# EAGLE design picoclick_c3_v1.1 (EAGLE 9.6.2)
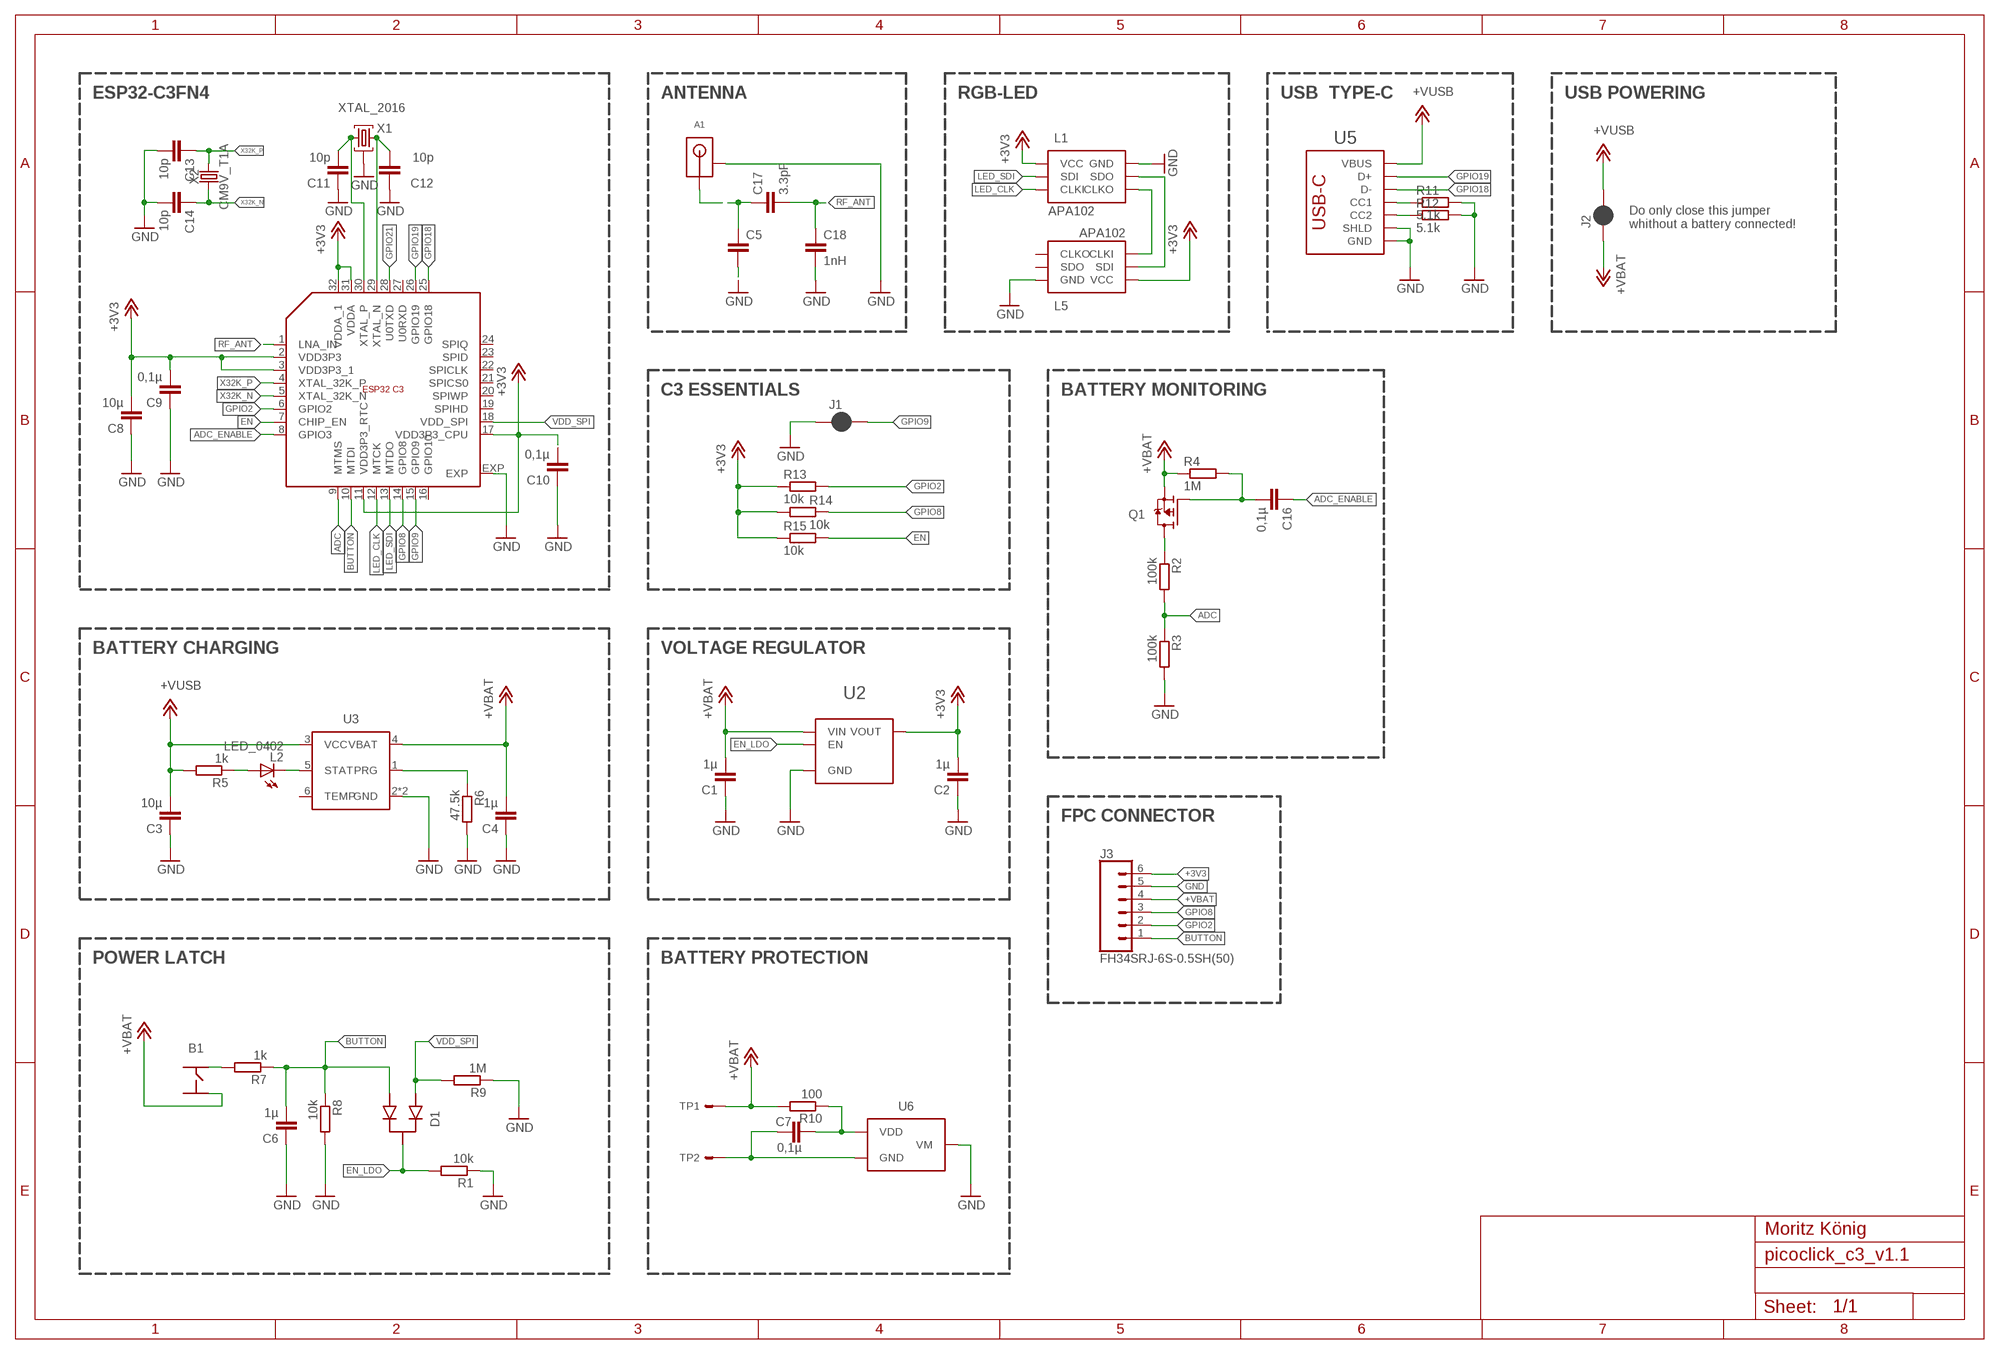
[diagram p0: schematic, sheet 1]

## Parts
A1  RFECA3216060A1T_NEW3_M  [RFECA3216060A1T_NEW3_M]
B1  BUTTON_4PIN  [BUTTON_SMD_12MM]
C1  1µ  C0402_S  [C0402_S]
C2  1µ  C0402_S  [C0402_S]
C3  10µ  C0402_S  [C0402_S]
C4  1µ  C0402_S  [C0402_S]
C5  C0402_S  [C0402_S]
C6  1µ  C0402_S  [C0402_S]
C7  0,1µ  C-EU-0402-WOKEEPOUT_S  [C0402_S]
C8  10µ  C0402_S  [C0402_S]
C9  0,1µ  C0402_S  [C0402_S]
C10  0,1µ  C0402_S  [C0402_S]
C11  10p  C0402_S  [C0402_S]
C12  10p  C0402_S  [C0402_S]
C13  10p  C-EU-0402-WOKEEPOUT_S  [C0402_S]
C14  10p  C-EU-0402-WOKEEPOUT_S  [C0402_S]
C16  0,1µ  C0402_S  [C0402_S]
C17  3.3pF  C0402_S  [C0402_S]
C18  1nH  C0402_S  [C0402_S]
D1  DAN222  [SOT523]
J1  SMT_JUMPER_2_NC_PASTE  [JUMPER_SMALL]
J2  JUMPER_SMALL  [JUMPER_SMALL]
J3  FH34SRJ-6S-0.5SH(50)  [FH34SRJ-6S-0.5SH(50)]
L1  APA102_2020  [APA102_2020]
L2  LED_0402  [CHIPLED_0402]
L5  APA102_2020  [APA102_2020]
Q1  WPM2031+SOT1123  [SOT723+1123]
R1  10k  R0402  [R0402]
R2  100k  R0402  [R0402]
R3  100k  R0402  [R0402]
R4  1M  R0402  [R0402]
R5  1k  R0402  [R0402]
R6  47.5k  R0402  [R0402]
R7  1k  R0402  [R0402]
R8  10k  R0402  [R0402]
R9  1M  R0402  [R0402]
R10  100  R-EU-0402-WOKEEPOUT  [R0402]
R11  5.1k  R0402  [R0402]
R12  5.1k  R0402  [R0402]
R13  10k  R0402  [R0402]
R14  10k  R0402  [R0402]
R15  10k  R0402  [R0402]
TP1  TP/SP-1.5X2.0  [SOLDERPAD_1.5X2.0]
TP2  TP/SP-1.5X2.0  [SOLDERPAD_1.5X2.0]
U1  ESP32_C3_QFN32  [QFN32]
U2  MIC5504  [TDFN4]
U3  WS4518D  [DFN-6]
U5  USB_C_C393939  [USBC_C393939]
U6  XB6042I2SV  [TDFN4]
X1  XTAL_2016  [XTAL_2016]
X2  CM9V_T1A  [XTAL_1016]

## Nets
+3V3: C2.P$2 C8.P$2 C9.P$2 C10.P$2 J3.6 L1.P1(VCC) L1.P1.1(VCC) L5.P1(VCC) L5.P1.1(VCC) R13.1 R14.1 R15.1 U1.2(VDD3P3) U1.3(VDD3P3_1) U1.11(VDD3P3_RTC) U1.17(VDD3P3_CPU) U1.31(VDDA) U1.32(VDDA_1) U2.P1(VOUT)
+VBAT: B1.P4 C1.P$2 C4.P$2 J2.P$1 J3.4 Q1.P$2(S) R4.1 R10.2 TP1.1(S) U2.P4(VIN) U3.4(VBAT)
+VUSB: C3.P$2 J2.P$2 R5.2 U3.3(VCC) U5.A4B9(VBUS) U5.B4A9(VBUS)
ADC: R2.2 R3.1 U1.9(MTMS)
ADC_ENABLE: C16.P$1 U1.8(GPIO3)
BUTTON: C6.P$2 D1.2 J3.1 R7.1 R8.1 U1.10(MTDI)
EN: R15.2 U1.7(CHIP_EN)
EN_LDO: D1.3 R1.2 U2.P3(EN)
GND: A1.PGND1(GND) A1.PGND2(GND) C1.P$1 C2.P$1 C3.P$1 C4.P$1 C5.P$2 C6.P$1 C8.P$1 C9.P$1 C10.P$1 C11.P$1 C12.P$1 C13.P$2 C14.P$2 C18.P$2 J1.P$1 J3.5 L1.P6(GND) L1.P6.1(GND) L5.P6(GND) L5.P6.1(GND) R1.1 R3.2 R6.2 R8.2 R9.1 R11.2 R12.2 U1.EXP U2.EXP(GND) U2.P2(GND) U3.2(GND) U3.EXP(GND) U5.A1B12(GND) U5.B1A12(GND) U5.S1(SHLD) U5.S2(SHLD) U5.S3(SHLD) U5.S4(SHLD) U6.P4(VM) X1.P2(G) X1.P4(G)
GPIO2: J3.2 R13.2 U1.6(GPIO2)
GPIO8: J3.3 R14.2 U1.14(GPIO8)
GPIO9: J1.P$2 U1.15(GPIO9)
GPIO18: U1.25(GPIO18) U5.A7(D-) U5.B7(D-)
GPIO19: U1.26(GPIO19) U5.A6(D+) U5.B6(D+)
GPIO21: U1.28(U0TXD)
LED_CLK: L1.P5(CLKI) U1.12(MTCK)
LED_SDI: L1.P4(SDI) U1.13(MTDO)
N$1: L1.P3(SDO) L5.P4(SDI)
N$2: R6.1 U3.1(PRG)
N$3: R12.1 U5.B5(CC2)
N$4: L1.P2(CLKO) L5.P5(CLKI)
N$7: R11.1 U5.A5(CC1)
N$11: A1.PFEED(ANT) C5.P$1 C17.P$1
N$12: C11.P$2 U1.30(XTAL_P) X1.P1
N$13: C12.P$2 U1.29(XTAL_N) X1.P3
N$15: B1.P2 R7.2
N$17: L2.P$2(A) R5.1
N$19: L2.P$1(C) U3.5(STAT)
N$20: Q1.P$3(D) R2.1
N$21: C16.P$2 Q1.P$1(G) R4.2
N$22: C7.P$2 R10.1 U6.P1(VDD)
N$24: C7.P$1 TP2.1(S) U6.EXP(GND) U6.P2(GND) U6.P3(GND)
RF_ANT: C17.P$2 C18.P$1 U1.1(LNA_IN)
VDD_SPI: D1.1 R9.2 U1.18(VDD_SPI)
X32K_N: C14.P$1 U1.5(XTAL_32K_N) X2.P$1
X32K_P: C13.P$1 U1.4(XTAL_32K_P) X2.P$2
Unconnected: B1.P1 B1.P3 L5.P2(CLKO) L5.P3(SDO) U1.16(GPIO10) U1.19(SPIHD) U1.20(SPIWP) U1.21(SPICS0) U1.22(SPICLK) U1.23(SPID) U1.24(SPIQ) U1.27(U0RXD) U3.6(TEMP)

## Notes on the sheet
- ESP32-C3FN4 | ANTENNA | RGB-LED | USB  TYPE-C | USB POWERING
- Do only close this jumper 
  whithout a battery connected!
- C3 ESSENTIALS | BATTERY MONITORING
- BATTERY CHARGING | VOLTAGE REGULATOR
- FPC CONNECTOR
- POWER LATCH | BATTERY PROTECTION
- Moritz König

## Library data of the parts
A1 = moekoe_antennas:RFECA3216060A1T
B1 = moekoe_switches:BUTTON_4PIN
C1-C6 C8-C12 C16-C18 = moekoe_rcl:C0402
C7 C13 C14 = moekoe:C-EU-0402-WOKEEPOUT
D1 = moekoe_discrete:DAN222
J1 = moekoe_pads_jumpers:SMT_JUMPER_2_NC_PASTE
J2 = moekoe:JUMPER_SMALL
J3 = moekoe_hardware:FH34SRJ-6S-0.5SH(50)
L1 L5 = moekoe_led:APA102_2020
L2 = moekoe_led:LED_0402
Q1 = moekoe_discrete:WPM2031
R1-R9 R11-R15 = moekoe_rcl:R0402
R10 = moekoe:R-EU-0402-WOKEEPOUT
TP1 TP2 = iml_elc:TP/SP: Solderpads/Testpads
U1 = moekoe_controllers:ESP32_C3_QFN32
U2 = moekoe_ics:MIC5504
U3 = moekoe_ics:WS4518D
U5 = moekoe_hardware:USB_C_C393939
U6 = moekoe:XB6042I2SV
X1 = moekoe_discrete:XTAL_2016
X2 = moekoe:CM9V_T1A

## Board
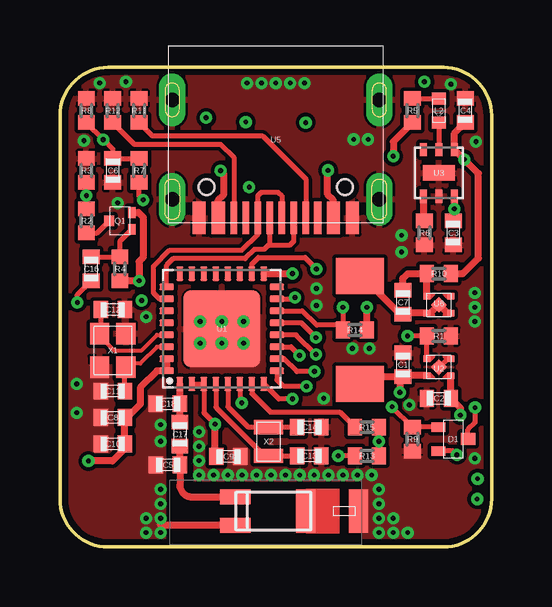
[diagram p1: board, top side]
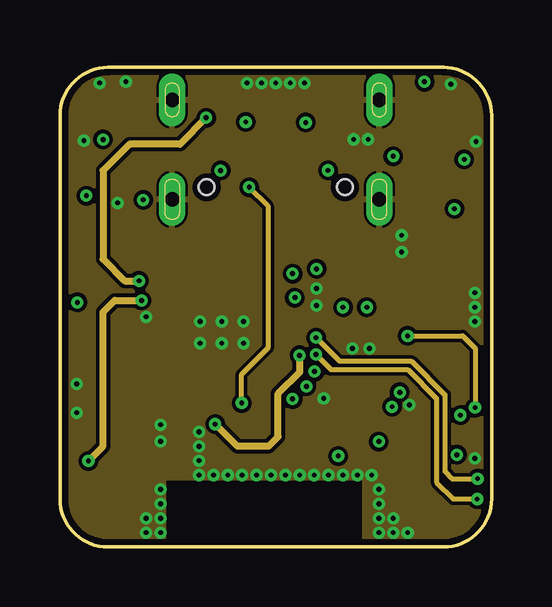
[diagram p2: board, inner layer Route2]
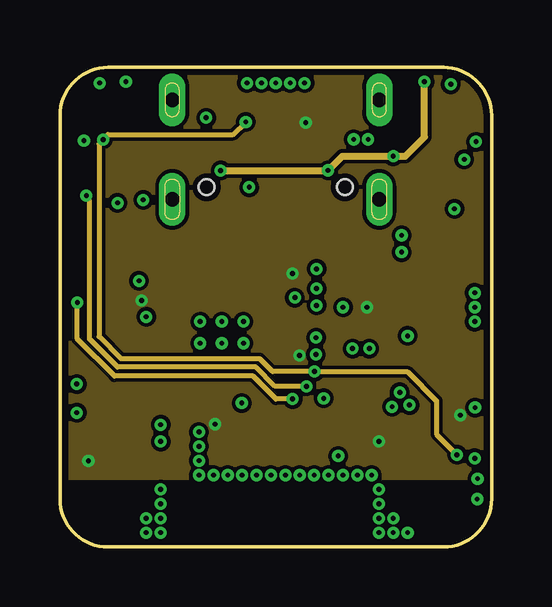
[diagram p3: board, inner layer Route15]
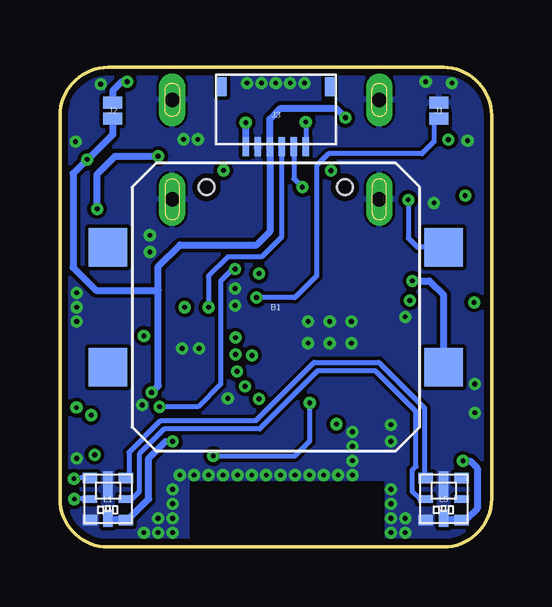
[diagram p4: board, bottom side, seen from below]

Size 18 x 20 mm. Coordinates in mm from the lower left corner, seen from the top.
Outline: 18,2 18,18 arc90 16,20 2,20 arc90 0,18 0,2 arc90 2,0 16,0 arc90 18,2
Copper layers (1+2*15+16): Top 0.035mm / dielectric 0.2mm / Route2 0.0175mm / dielectric 0.265mm / Route15 0.0175mm / dielectric 0.2mm / Bottom 0.035mm
Design rules "2020.08.24_4layers_eagle *": minimum track width 6mil, minimum drill 0.2mm, track to track 6mil, track to pad 6mil, pad to pad 6mil, via to via 6mil, smd to smd 6mil, copper to edge 10mil, drill to drill 6mil, minimum pad ring 10mil, minimum via ring 6mil, stop-mask expansion 0mil, vias tented up to drill 0.5mm, thermal gap 4mil
tRestrict: area 4.5,2.8 to 5.5,6.8

### Footprints (pad centres in the part's own frame; a part is rotated, then mirrored left to right if it is on the bottom)
RFECA3216060A1T_NEW3_M = smd 0.8 x 1.8: P2 -1.25,-0.1; PGND2 -3.45,-0.1 | smd 1.27 x 0.635: PFEED 1.685,-0.69; PGND1 1.685,0.49
BUTTON_SMD_12MM = smd 1.6 x 1.6: P1 -7,2.5; P2 7,2.5; P3 -7,-2.5; P4 7,-2.5
C0402_S = smd 0.6 x 0.7: P$1 -0.5,0; P$2 0.5,0
SOT523 = smd 0.4 x 0.6: 1 0.5,0.62; 2 -0.5,0.62 | smd 0.5 x 0.6: 3 0,-0.62
JUMPER_SMALL = smd 0.5 x 0.8: P$1 -0.33,0; P$2 0.33,0
FH34SRJ-6S-0.5SH(50) = smd 0.28 x 0.8: 1 -1.25,0; 2 -0.75,0; 3 -0.25,0; 4 0.25,0; 5 0.75,0; 6 1.25,0 | smd 0.4 x 0.8: P$1 -2.25,-2.5; P$2 2.25,-2.5
APA102_2020 = smd 0.6 x 0.45: P1 -0.75,0.875; P3 -0.75,-0.875; P4 0.75,-0.875; P6 0.75,0.875 | smd 0.4 x 0.7: P1.1 0,0.8 | smd 0.6 x 0.3: P2 -0.75,0; P5 0.75,0 | smd 0.4 x 1.1: P6.1 0,-0.6
CHIPLED_0402 = smd 0.5 x 0.6: P$1 -0.5,0; P$2 0.5,0
SOT723+1123 = smd 0.45 x 0.3: P$1 -0.35,-0.5; P$2 0.35,-0.5 | smd 0.45 x 0.4: P$3 0,0.45
R0402 = smd 0.6 x 0.7: 1 -0.5,0; 2 0.5,0
SOLDERPAD_1.5X2.0 = smd 2 x 1.5: 1 0,0
QFN32 = smd 0.6 x 0.275: 1 -2.3,1.75; 2 -2.3,1.25; 3 -2.3,0.75; 4 -2.3,0.25; 5 -2.3,-0.25; 6 -2.3,-0.75; 7 -2.3,-1.25; 8 -2.3,-1.75; 17 2.3,-1.75; 18 2.3,-1.25; 19 2.3,-0.75; 20 2.3,-0.25; 21 2.3,0.25; 22 2.3,0.75; 23 2.3,1.25; 24 2.3,1.75 | smd 0.275 x 0.6: 9 -1.75,-2.3; 10 -1.25,-2.3; 11 -0.75,-2.3; 12 -0.25,-2.3; 13 0.25,-2.3; 14 0.75,-2.3; 15 1.25,-2.3; 16 1.75,-2.3; 25 1.75,2.3; 26 1.25,2.3; 27 0.75,2.3; 28 0.25,2.3; 29 -0.25,2.3; 30 -0.75,2.3; 31 -1.25,2.3; 32 -1.75,2.3 | smd 3.2 x 3.2: EXP 0,0
TDFN4 = smd 0.48 x 0.48 rotated 45: EXP 0,0 | smd 0.25 x 0.3: P1 -0.35,-0.5; P2 0.35,-0.5; P3 0.35,0.5; P4 -0.35,0.5
DFN-6 = smd 0.55 x 0.3: 1 -0.975,0.65; 2 -0.975,0; 3 -0.975,-0.65; 4 0.975,-0.65; 5 0.975,0; 6 0.975,0.65 | smd 0.65 x 1.35: EXP 0,0
USBC_C393939 = smd 0.55 x 1.35: A1B12 -3.2,0.775; A4B9 -2.4,0.775; B1A12 3.2,0.775; B4A9 2.4,0.775 | smd 0.275 x 1.35: A5 -1.25,0.775; A6 -0.25,0.775; A7 0.25,0.775; B5 1.75,0.775; B6 0.75,0.775; B7 -0.75,0.775; B8 1.25,0.775 | smd 0.3 x 1.35: A8 -1.75,0.775 | drill 0.6 pad 1 long: S1 -4.32,0; S2 4.32,0; S3 -4.32,-4.15; S4 4.32,-4.15 | hole 0.65: 2.89,-0.5; -2.89,-0.5
XTAL_2016 = smd 0.9 x 0.8: P1 -0.7,-0.55; P2 0.7,-0.55; P3 0.7,0.55; P4 -0.7,0.55
XTAL_1016 = smd 0.6 x 1.2: P$1 -0.6,0; P$2 0.6,0

### Placement (x,y rotation side)
A1  9,1.4 180 top
B1  9,10 0 bottom
C1  14.3,7.6 270 top
C2  15.8,6.2 0 top
C3  16.4,13.1 90 top
C4  16.9,18.2 270 top
C5  4.5,3.42 180 top
C6  2.2,15.7 90 top
C7  14.3,10.2 90 top
C8  2.2,5.4 0 top
C9  7.03,3.77 180 top
C10  2.2,4.3 0 top
C11  2.2,6.5 0 top
C12  2.2,9.9 180 top
C13  10.4,3.8 0 top
C14  10.4,5 0 top
C16  1.3,11.6 90 top
C17  5,4.7 90 top
C18  4.5,5.97 180 top
D1  16.4,4.5 90 top
J1  2.2,18.2 270 bottom
J2  15.8,18.2 90 bottom
J3  9,16.7 180 bottom
L1  16,2 180 bottom
L2  15.8,18.2 90 top
L5  2,2 180 bottom
Q1  2.5,13.6 90 top
R1  15.8,8.8 180 top
R2  1.1,13.6 90 top
R3  1.1,15.7 90 top
R4  2.5,11.6 90 top
R5  14.7,18.2 270 top
R6  15.2,13.1 270 top
R7  3.3,15.7 270 top
R8  1.1,18.2 90 top
R9  14.7,4.5 90 top
R10  15.8,11.4 0 top
R11  3.3,18.2 90 top
R12  2.2,18.2 90 top
R13  12.8,3.8 180 top
R14  12.3,9.05 180 top
R15  12.8,5 180 top
TP1  12.5,6.8 0 top
TP2  12.5,11.3 0 top
U1  6.75,9.1 90 top
U2  15.8,7.5 90 top
U3  15.8,15.6 90 top
U5  9,14.5 180 top
U6  15.8,10.1 270 top
X1  2.2,8.2 90 top
X2  8.7,4.4 270 top

### Tracks (layer width: path | path; a pad name or v marks a point on that pad's centre or on a via)
+3V3  (via drill 0.2 pad 0.4)
  Top 0.2: U1.2 U1.3 6,5.6 v6.47,5.12 | U1.11 9.64,8.35 v9.99,8
  Top 0.3: U2.P1 C2.P$2 16.7,5.8 v16.7,5.5 | R15.1 v13.3,4.4 R13.1 | U1.17 v9.7,11.4 | U1.31 U1.32 4.05,7.35 3.35,6.65 3.35,5.95 2.8,5.4 C8.P$2 C10.P$2 2.7,4.1 2.19,3.59 v1.19,3.59 | R14.1 v12.8,10 | C9.P$2 6.47,3.77 v6.47,5.12
  Route2 0.3: v6.47,5.12 7.4,4.2 8.7,4.2 9.1,4.6 9.1,6.4 9.99,7.29 v9.99,8 | v1.19,3.59 1.8,4.2 1.8,9.8 2.28,10.28 v3.4,10.28
  Bottom 0.3: L5.P1.1 1.93,1.12 L5.P1 1.07,1.12 0.6,1.6 0.6,3.3 0.89,3.59 v1.19,3.59 | L1.P1.1 15.93,1.12 L1.P1 15.18,1.12 14.29,2 14.29,3.71 13.6,4.4 v13.3,4.4 | J3.6 v10.25,17.7
  pour Route15: 0.25,2.88 0.25,17.75 arc-90 2.25,19.75 15.75,19.75 arc-90 17.75,17.75 17.75,2.88
+VBAT  (via drill 0.2 pad 0.4)
  Top 0.3: U2.P4 14.35,7.15 C1.P$2 | C1.P$2 12.8,7.1 TP1.1 | C4.P$2 16.45,17.25 U3.4 v16.86,16.16 17.45,15.57 17.45,12.05 16.8,11.4 R10.2 | R4.1 v3.3,11.1 3.3,11.9 3.48,12.07 3.48,13.75 3.27,13.95 Q1.P$2 | C1.P$2 14.18,6.97 v14.18,6.45
  Route2 0.3: v6.1,17.9 5,16.8 2.9,16.8 1.8,15.7 1.8,12 2.7,11.1 v3.3,11.1
  Bottom 0.3: J2.P$1 15.8,17.2 16.84,16.16 v16.86,16.16 17.45,15.57 17.45,11.65 16.5,10.7 13.9,10.7 | B1.P4 2,10.5 2.6,11.1 v3.3,11.1 | v14.18,6.45 13.9,6.72 13.9,10.7 | 13.9,10.7 13.9,11.7 13,12.6 9.8,12.6 9.25,13.15 J3.4 9.25,17.85 8.8,18.3 6.5,18.3 v6.1,17.9
+VUSB  (via drill 0.2 pad 0.4)
  Top 0.3: U5.B4A9 6.6,14.46 6.84,14.7 6.84,15.56 v6.7,15.7 | U5.A4B9 11.4,14.46 11.16,14.7 11.16,15.69 v11.18,15.71 | U3.3 v16.45,14.1 16.45,13.65 C3.P$2 | R5.2 13.9,16.9 v13.9,16.3
  Route15 0.3: v6.7,15.7 v11.18,15.7 v11.18,15.71 11.78,16.3 v13.9,16.3 14.4,16.3 15.2,17.1 v15.2,19.4
  Bottom 0.3: v15.2,19.4 15.43,19.4 15.8,19.03 J2.P$2 | v16.45,14.1 16.45,15.55 15.7,16.3 v13.9,16.3
ADC  (via drill 0.2 pad 0.4)
  Top 0.2: R3.1 v1.1,14.65 R2.2 | v10.28,6.7 9.32,6.7 9.05,6.97 U1.9
  Route15 0.2: v10.28,6.7 8.97,6.7 8.18,7.5 2.4,7.5 1.23,8.67 1.23,14.45 1.1,14.57 v1.1,14.65
ADC_ENABLE  (via drill 0.2 pad 0.4)
  Top 0.2: U1.8 9.12,6.17 v9.7,6.17 | v0.72,10.2 0.72,10.53 C16.P$1
  Route15 0.2: v9.7,6.17 9,6.17 8.05,7.12 2.27,7.12 0.72,8.68 v0.72,10.2
BUTTON  (via drill 0.2 pad 0.4)
  Top 0.2: U1.10 9.35,7.85 9.88,7.32 v10.62,7.32 | R8.1 v1.8,17 | v1.8,17 2.2,16.6 C6.P$2 R7.1 | v1.8,17 | v16.56,3.85 16.4,4 D1.2
  Route15 0.2: v16.56,3.85 15.7,4.7 15.7,6.1 14.48,7.32 v10.62,7.32 8.87,7.32 8.33,7.85 2.54,7.85 1.62,8.77 1.62,16.82 v1.8,17 2,17.2 7.22,17.2 v7.75,17.73
  Bottom 0.2: v7.75,17.73 J3.1
EN
  Top 0.2: U1.7 8,6.4 8.78,5.62 11.68,5.62 R15.2
EN_LDO  (via drill 0.2 pad 0.4)
  Top 0.2: U2.P3 R1.2 v14.51,8.8 v14.5,8.8 | D1.3 17.02,4.9 17.32,5.2 v17.32,5.82
  Route2 0.2: v14.5,8.8 16.8,8.8 17.32,8.29 v17.32,5.82
GND  (via drill 0.2 pad 0.4)
  Top 0.2: U2.EXP 16.15,7.85 U2.P2
  Top 0.3: A1.PGND1 4.2,0.91 v4.2,1.2
  other vias: 16.3,19.3 4.2,2.4 4.2,1.8 4.2,0.6 6.4,3 7,3 7.6,3 8.2,3 8.8,3 9.4,3 10,3 10.6,3 11.2,3 11.8,3 12.4,3 13,3 13.3,2.4 13.3,1.8 13.3,1.2 13.3,0.6 6.75,8.5 13.9,0.6 14.5,0.6 3.6,0.6 3.6,1.2 13.9,1.2 3.6,9.6 0.7,6.8 1,16.95 2.4,14.35 17.3,10.6 17.3,10 17.3,9.4 14.57,5.92 6.75,9.4 5.85,8.5 5.85,9.4 7.65,9.4 7.65,8.5 9,19.35 8.4,19.35 7.8,19.35 9.6,19.35 10.2,19.35 2.75,19.4 1.65,19.35 12.25,17 12.85,17 14.25,13 11,6.2 17.3,3.7 0.7,5.6 17.35,16.9 14.25,12.3 12.2,8.28 12.9,8.28 10.7,10.78 10.7,10.07 5.8,3 5.8,3.6 5.8,4.2 5.8,4.8 4.2,4.4 4.2,5.1
  pour Route2: 0.25,2.85 0.25,17.75 arc-90 2.25,19.75 15.75,19.75 arc-90 17.75,17.75 17.75,2.85
  pour Top: 0.25,6.95 0.25,17.75 arc-90 2.25,19.75 15.75,19.75 arc-90 17.75,17.75 17.75,6.95
  pour Bottom: 0.25,2.85 0.25,17.75 arc-90 2.25,19.75 15.75,19.75 arc-90 17.75,17.75 17.75,2.85
  pour Top (no thermals): 12.7,3.7 12.7,0.25 15.75,0.25 arc90 17.75,2.25 17.75,3.7
  pour Top (no thermals): 0.25,7.5 0.25,2.25 arc90 2.25,0.25 4.35,0.25 4.35,7.5
  pour Top (no thermals): 5.5,9.6 5.5,2.85 9.4,2.85 9.4,9.6
  pour Bottom (no thermals): 0.25,3.4 0.25,2.25 arc90 2.25,0.25 4.35,0.25 4.35,3.4
  pour Route2 (no thermals): 0.25,3.4 0.25,2.25 arc90 2.25,0.25 4.35,0.25 4.35,3.4
  pour Bottom (no thermals): 12.7,3.7 12.7,0.25 15.75,0.25 arc90 17.75,2.25 17.75,3.7
  pour Route2 (no thermals): 12.7,3.7 12.7,0.25 15.75,0.25 arc90 17.75,2.25 17.75,3.7
  pour Top: 8.8,9.6 8.8,2.85 17.73,2.85 17.73,9.6
GPIO2  (via drill 0.2 pad 0.4)
  Top 0.2: U1.6 7.5,6.09 v7.58,6 | R13.2 v11.61,3.8
  Route2 0.2: v7.58,6 7.58,7.21 8.67,8.29 8.67,14.23 v7.89,15.01
  Bottom 0.2: v11.61,3.8 8.2,3.8 7.58,4.42 v7.58,6 | J3.2 8.25,15.36 v7.89,15.01
GPIO8  (via drill 0.2 pad 0.4)
  Top 0.2: U1.14 10.1,9.85 10.7,9.25 11.6,9.25 R14.2 v11.8,9.99 v11.8,10
  Bottom 0.2: J3.3 8.75,12.95 9.6,12.1 11,12.1 11.8,11.29 v11.8,10
GPIO9  (via drill 0.2 pad 0.4)
  Top 0.2: U1.15 9.8,10.35 v9.8,10.4
  Bottom 0.2: J1.P$2 2.4,17.67 2.4,16.9 2.9,16.4 6.8,16.4 7.3,15.9 7.3,11.3 8.2,10.4 v9.8,10.4
GPIO18
  Top 0.2: U1.25 4.45,11.75 4.72,12.03 7.72,12.03 8.12,12.43 8.53,12.43 8.75,12.65 | 8.75,12.65 8.75,12.6 9.6,12.6 9.75,12.75 U5.B7 | 8.75,12.65 U5.A7
GPIO19
  Top 0.2: U1.26 4.15,10.35 3.9,10.6 3.9,11.7 4.58,12.38 7.58,12.38 8.25,13.05 U5.B6 8.25,14.65 8.4,14.8 9.1,14.8 9.25,14.65 U5.A6
LED_CLK  (via drill 0.2 pad 0.4)
  Top 0.2: v10.68,8.03 9.85,8.85 U1.12
  Route2 0.2: v17.4,2 16.4,2 15.7,2.7 15.7,6.2 14.5,7.4 11.3,7.4 v10.68,8.03
  Bottom 0.2: L1.P5 v17.4,2
LED_SDI  (via drill 0.2 pad 0.4)
  Top 0.2: v10.68,8.73 10.06,9.35 U1.13
  Route2 0.2: v10.68,8.73 11.66,7.75 14.65,7.75 16.05,6.35 16.05,3.15 16.35,2.85 v17.42,2.85
  Bottom 0.2: L1.P4 17.39,2.88 v17.42,2.85
N$1
  Bottom 0.2: L5.P4 2.8,2.92 2.8,5.8 4.7,7.7 7.4,7.7 9.82,5.28 13.8,5.28 15.12,3.95 15.12,3 L1.P3
N$2
  Top 0.3: U3.1 15.15,13.65 R6.1
N$3
  Top 0.2: U5.B5 7.25,16.25 6.7,16.8 3.1,16.8 R12.1
N$4
  Bottom 0.2: L1.P2 15,2 14.7,2.3 14.7,3.88 13.65,4.92 9.68,4.92 7.25,7.35 4.85,7.35 3.15,5.65 3.15,3.35 3.3,3.21 3.3,2.3 3,2 L5.P5
N$7
  Top 0.2: U5.A5 10.25,15.35 8.45,17.15 3.85,17.15 R11.1
N$11
  Top 0.3: C17.P$1 C5.P$1 5,2.59 arc90 5.5,2.09 A1.PFEED
N$12
  Top 0.16: U1.30 4.05,8.35 3.35,7.65 2.9,7.65 2.7,7.45
  Top 0.2: C11.P$2 2.7,7.45 X1.P1
N$13
  Top 0.16: X1.P3 1.65,8.82 2.26,8.21 3.41,8.21 4.05,8.85 U1.29
  Top 0.2: C12.P$2 1.7,8.95 X1.P3
N$15  (via drill 0.2 pad 0.4)
  Top 0.2: v3.48,14.47 3.3,14.65 R7.2
  Bottom 0.2: v3.48,14.47 3.48,12.88 3.1,12.5 B1.P2
N$17
  Top 0.2: R5.1 L2.P$2
N$19
  Top 0.2: L2.P$1 U3.5
N$20
  Top 0.2: R2.1 1.55,13.1 Q1.P$3
N$21
  Top 0.2: Q1.P$1 2.5,12.75 R4.2 C16.P$2
N$22
  Top 0.3: U6.P1 R10.1 14.5,11.4 14.3,11.2 C7.P$2
N$24
  Top 0.3: U6.P3 16.15,9.75 U6.EXP 15.45,9.75 U6.P2 14.35,9.75 C7.P$1 14.2,9.7 12.6,11.3 TP2.1
RF_ANT
  Top 0.3: U1.1 C18.P$1 C17.P$2
VDD_SPI  (via drill 0.2 pad 0.4)
  Top 0.2: D1.1 R9.2 v13.85,5.85 | U1.18 8,11.8 8.28,12.07 10.22,12.07 v10.7,11.6
  Bottom 0.2: v13.85,5.85 12.25,5.85 11.3,6.8 11.3,11.1 10.8,11.6 v10.7,11.6
X32K_N
  Top 0.2: U1.5 7,5.85 7.85,5 X2.P$1 C14.P$1
X32K_P
  Top 0.2: U1.4 6.5,5.83 8.53,3.8 X2.P$2 C13.P$1